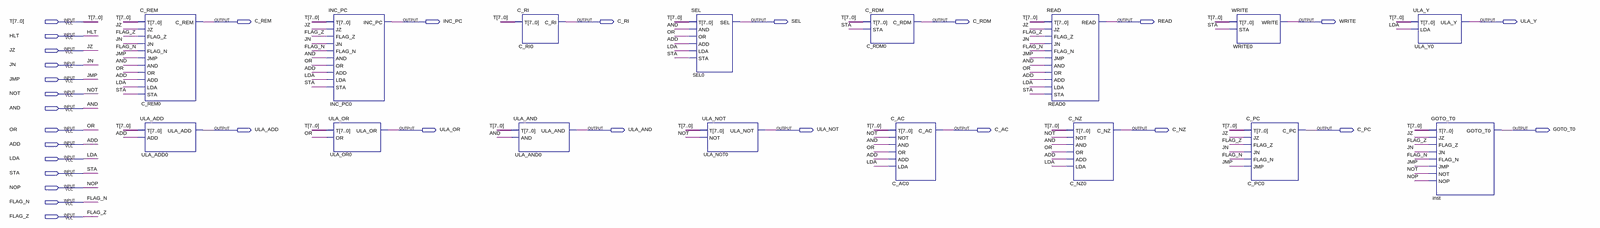
[diagram p0: schematic sheet, whole]
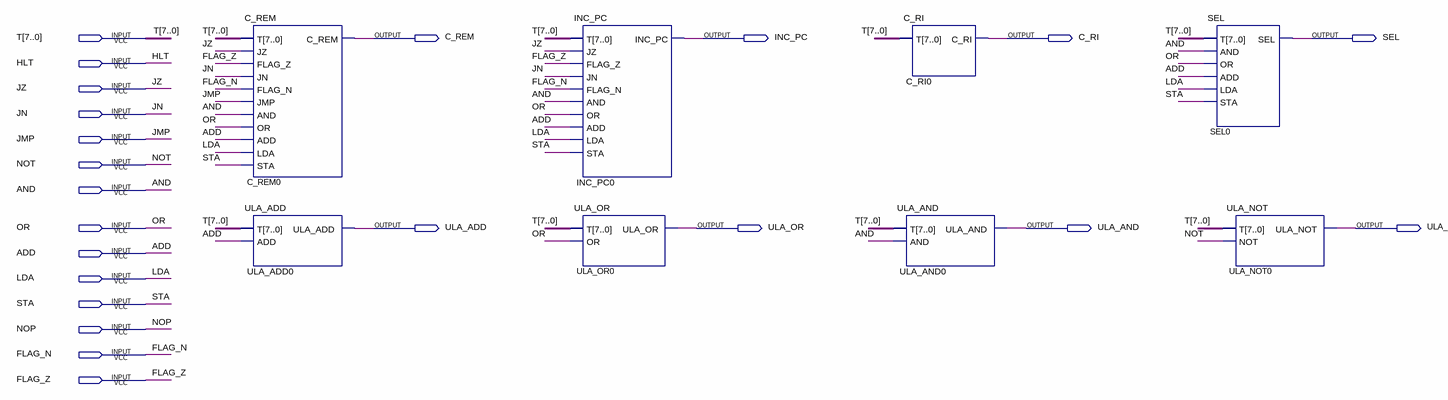
[diagram p1: schematic sheet, left part]
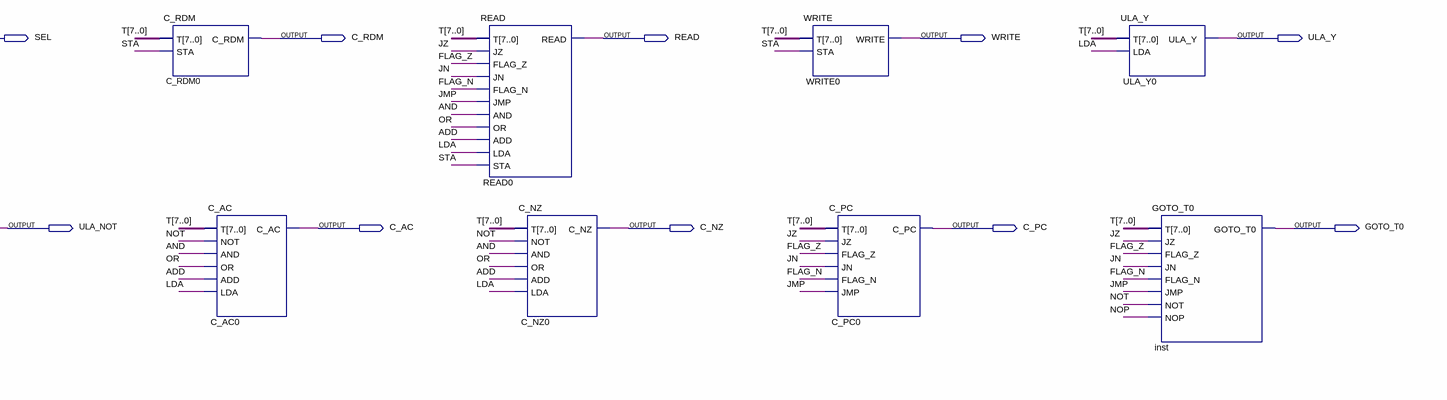
[diagram p2: schematic sheet, right part]
// Quartus schematic CONT_UNIT.bdf as structural Verilog: 16 symbols, 30 pins
module CONT_UNIT (
  input  [7:0] T,
  input  HLT,
  input  JZ,
  input  JN,
  input  JMP,
  input  NOT,
  input  AND,
  input  OR,
  input  ADD,
  input  LDA,
  input  STA,
  input  NOP,
  input  FLAG_N,
  input  FLAG_Z,
  output C_REM,
  output INC_PC,
  output C_RI,
  output SEL,
  output C_RDM,
  output READ,
  output WRITE,
  output ULA_Y,
  output ULA_ADD,
  output ULA_OR,
  output ULA_AND,
  output ULA_NOT,
  output C_AC,
  output C_NZ,
  output C_PC,
  output GOTO_T0
);

  C_REM C_REM0 (
    .T(T), .JZ(JZ), .FLAG_Z(FLAG_Z), .JN(JN), .FLAG_N(FLAG_N), .JMP(JMP), .AND(AND), .OR(OR), .ADD(ADD),
    .LDA(LDA), .STA(STA), .C_REM(C_REM));
  ULA_ADD ULA_ADD0 (.T(T), .ADD(ADD), .ULA_ADD(ULA_ADD));
  INC_PC INC_PC0 (
    .T(T), .JZ(JZ), .FLAG_Z(FLAG_Z), .JN(JN), .FLAG_N(FLAG_N), .AND(AND), .OR(OR), .ADD(ADD), .LDA(LDA),
    .STA(STA), .INC_PC(INC_PC));
  ULA_OR ULA_OR0 (.T(T), .OR(OR), .ULA_OR(ULA_OR));
  C_RI C_RI0 (.T(T), .C_RI(C_RI));
  ULA_AND ULA_AND0 (.T(T), .AND(AND), .ULA_AND(ULA_AND));
  SEL SEL0 (.T(T), .AND(AND), .OR(OR), .ADD(ADD), .LDA(LDA), .STA(STA), .SEL(SEL));
  ULA_NOT ULA_NOT0 (.T(T), .NOT(NOT), .ULA_NOT(ULA_NOT));
  C_RDM C_RDM0 (.T(T), .STA(STA), .C_RDM(C_RDM));
  C_AC C_AC0 (.T(T), .NOT(NOT), .AND(AND), .OR(OR), .ADD(ADD), .LDA(LDA), .C_AC(C_AC));
  READ READ0 (
    .T(T), .JZ(JZ), .FLAG_Z(FLAG_Z), .JN(JN), .FLAG_N(FLAG_N), .JMP(JMP), .AND(AND), .OR(OR), .ADD(ADD),
    .LDA(LDA), .STA(STA), .READ(READ));
  C_NZ C_NZ0 (.T(T), .NOT(NOT), .AND(AND), .OR(OR), .ADD(ADD), .LDA(LDA), .C_NZ(C_NZ));
  WRITE WRITE0 (.T(T), .STA(STA), .WRITE(WRITE));
  C_PC C_PC0 (.T(T), .JZ(JZ), .FLAG_Z(FLAG_Z), .JN(JN), .FLAG_N(FLAG_N), .JMP(JMP), .C_PC(C_PC));
  ULA_Y ULA_Y0 (.T(T), .LDA(LDA), .ULA_Y(ULA_Y));
  GOTO_T0 inst (
    .T(T), .JZ(JZ), .FLAG_Z(FLAG_Z), .JN(JN), .FLAG_N(FLAG_N), .JMP(JMP), .NOT(NOT), .NOP(NOP),
    .GOTO_T0(GOTO_T0));
endmodule
